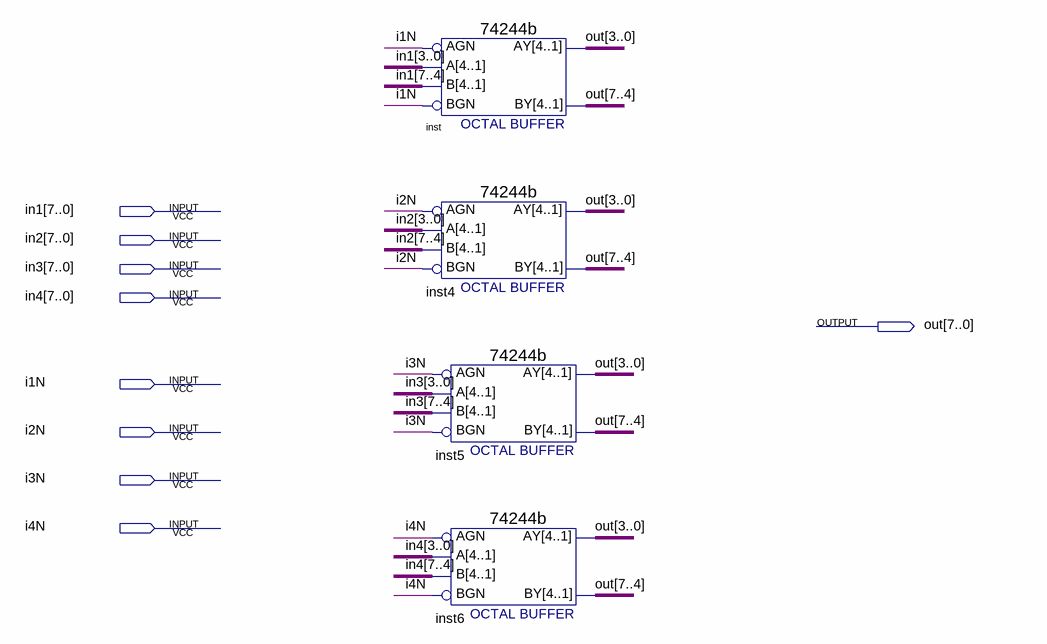
[diagram p0: schematic sheet]
// Quartus schematic Mux4_1.bdf as structural Verilog: 4 symbols, 9 pins
module Mux4_1 (
  input  [7:0] in1,
  input  [7:0] in2,
  input  [7:0] in3,
  input  [7:0] in4,
  input  i1N,
  input  i2N,
  input  i3N,
  input  i4N,
  output [7:0] out
);

  \74244b  inst (.AGN(i1N), .B(in1[7:4]), .BGN(i1N), .A(in1[3:0]), .AY(out[3:0]), .BY(out[7:4]));
  \74244b  inst4 (.AGN(i2N), .B(in2[7:4]), .BGN(i2N), .A(in2[3:0]), .AY(out[3:0]), .BY(out[7:4]));
  \74244b  inst5 (.AGN(i3N), .B(in3[7:4]), .BGN(i3N), .A(in3[3:0]), .AY(out[3:0]), .BY(out[7:4]));
  \74244b  inst6 (.AGN(i4N), .B(in4[7:4]), .BGN(i4N), .A(in4[3:0]), .AY(out[3:0]), .BY(out[7:4]));
endmodule
